# Altium schematic sheet Power.SchDoc
size A3
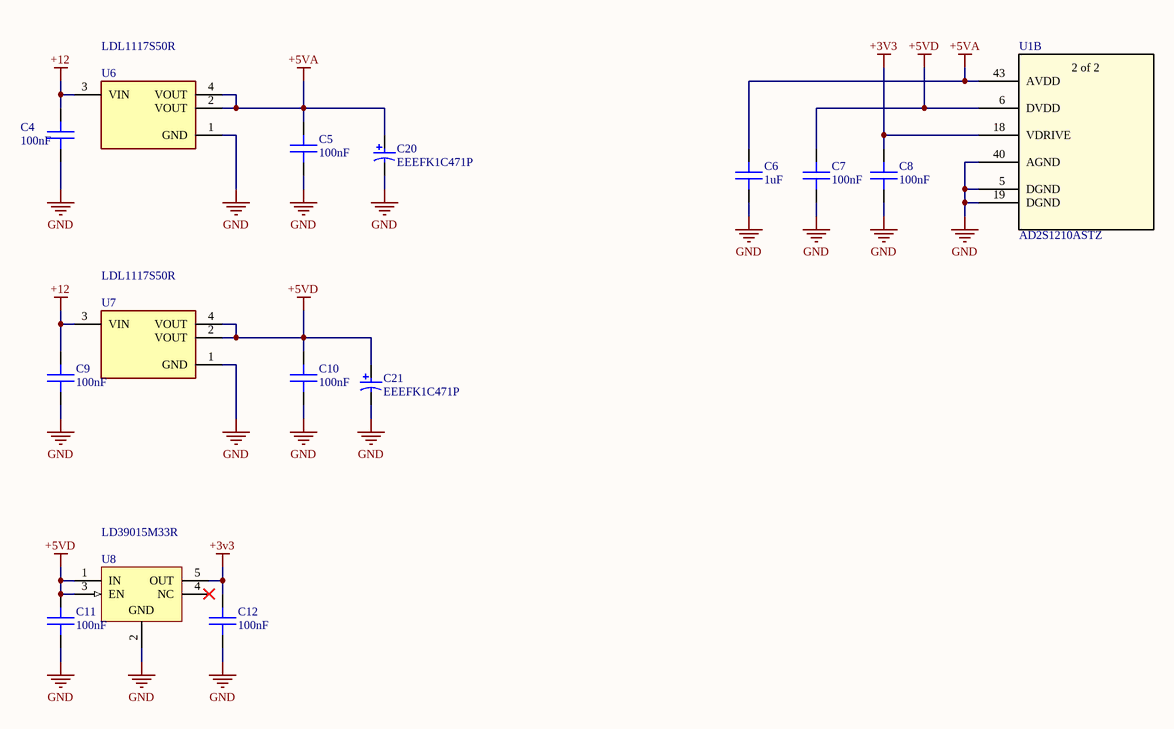
[diagram p0: Power.SchDoc]

## Parts
C4  value 100nF  [C0603 (1608)]  (hidden comment: Cap SMD)
C5  value 100nF  [C0603 (1608)]  (hidden comment: Cap SMD)
C6  value 1uF  [C0603 (1608)]  (hidden comment: Cap SMD)
C7  value 100nF  [C0603 (1608)]  (hidden comment: Cap SMD)
C8  value 100nF  [C0603 (1608)]  (hidden comment: Cap SMD)
C9  value 100nF  [C0603 (1608)]  (hidden comment: Cap SMD)
C10  value 100nF  [C0603 (1608)]  (hidden comment: Cap SMD)
C11  value 100nF  [C0603 (1608)]  (hidden comment: Cap SMD)
C12  value 100nF  [C0603 (1608)]  (hidden comment: Cap SMD)
C20  EEEFK1C471P  [PNSC-FK-V-F_V]
C21  EEEFK1C471P  [PNSC-FK-V-F_V]
U1  AD2S1210ASTZ  [ST_48_ADI]  (part B of 2)
U6  LDL1117S50R  [FP-SOT-223-0046067_14-MFG]
U7  LDL1117S50R  [FP-SOT-223-0046067_14-MFG]
U8  LD39015M33R  [SOT23-5L_M]

## Nets
+3V3: C8.2 C12.2 U1.18(VDRIVE) U8.5(OUT)
+5VA: C5.2 C6.2 C20.1 U1.43(AVDD) U6.2(VOUT) U6.4(VOUT)
+5VD: C7.2 C10.2 C11.2 C21.1 U1.6(DVDD) U7.2(VOUT) U7.4(VOUT) U8.1(IN) U8.3(EN)
+12: C4.2 C9.2 U6.3(VIN) U7.3(VIN)
GND: C4.1 C5.1 C6.1 C7.1 C8.1 C9.1 C10.1 C11.1 C12.1 C20.2 C21.2 U1.5(DGND) U1.19(DGND) U1.40(AGND) U6.1(GND) U7.1(GND) U8.2(GND)

Not connected (* = marked no-connect by the designer): U8 4(NC)*

## Notes on the sheet
- (in symbol AD2S1210ASTZ, part B) 2 of 2

## Library data of the parts
C20 C21 = CMP-2000-06204-1: Aluminum Electrolytic Capacitor, 470 uF, +/- 20%, 16 V, 2-Pin SMD (Size Code F), -55 to 105 degC, RoHS, Tape and Reel; Manufacturer: Panasonic; Capacitance: 470µF; Type: Can; Ripple Current: 600mA; Lifetime@Temperature: 2000Hrs@105°C; Impedance: 0.16O; Rated Voltage: 16V; Manufacturer URL: http://www.panasonic.com/; Package Description: 2-Pin Electrolytic Aluminum Capacitor, Body 8.3 x 8.3 mm; Operating Temp-Max: 105°C; Mounting Technology: SurfaceMount; Operating Temp Range: -55to+105°C; Datasheet Version: 03/2016; Series: FK; Package Reference: FK-V-F; Case Size/Dimension: Ø8x10.2mm; Package URL: http://industrial.panasonic.com/cdbs/www-data/pdf/RDE0000/DME0000COL48.pdf; Datasheet URL: http://industrial.panasonic.com/cdbs/www-data/pdf/RDE0000/ABA0000C1181.pdf
U1 = AD2S1210ASTZ: No Description Available; SourceLibrary: Analog_2015-12-15; Built_By: EMA_UL_Team; Vendor: Analog Devices Inc; Manufacturer_Part_Number: AD2S1210ASTZ; Copyright: Copyright (C) 2018 Accelerated Designs. All rights reserved; RefDes: RefDes; Type: DEV
U6 U7 = CMP-12153-000005-1: IC REG LINEAR 5V 1.2A SOT223; Manufacturer: STMicroelectronics; Standoff Height: 0.02mm; Min Supply Voltage: 2.6V; Nominal Supply Current: 250uA; Max Junction Temp: +150°C; Accuracy Percentage: 2%; Output Type: Fixed; Max Supply Voltage: 18V; Output Current: 2A; Number Of Outputs: 1; Dropout Voltage: 350mV; ComponentLink2Description: Datasheet; Temperature Range High: +125°C; Manufacturer Part Number: LDL1117S50R; Digikey Description: IC REG LINEAR 5V 1.2A SOT223; Device Class L2: Power Management ICs; RoHS: TRUE; Temperature: -40°C to +125°C; Device Class L3: Voltage Regulators - Linear; Automotive: No; Mouser Description: LDL1117 Series 1.2 A 5 V High PSRR LDO Linear Voltage Regulator - SOT-223; Package: SOT-223-0046067_14; ComponentLink2URL: https://www.st.com/content/ccc/resource/technical/document/datasheet/group3/0e/5a/00/ca/10/1a/4f/a5/DM00366442/files/DM00366442.pdf/jcr:content/translations/en.DM00366442.pdf; Output Voltage: 5V; Octopart: https://octopart.com/ldl1117s50r-stmicroelectronics-81876164; Category: IC; Device Class L1: Integrated Circuits (ICs); Temperature Range Low: -40°C; Height: 1.9mm; Lead Free: Yes
U8 = CMP-0244-00351-1: 150 mA Low Quiescent Current Low Noise Voltage Regulator, 3.3V, 5-Pin SOT-23, Tape and Reel; PackageReference: SOT23-5L; ComponentLink1URL: http://www.st.com; PackageDescription: 5-Pin SOT-23 Package, 2.9 x 1.6 mm Body, 0.95 mm Pitch, 2.8 mm Lead Span; ComponentLink2Description: Datasheet; DatasheetVersion: 1/02/2009; ComponentLink1Description: Manufacturer URL; ComponentLink2URL: http://www.st.com/internet/com/TECHNICAL_RESOURCES/TECHNICAL_LITERATURE/DATASHEET/CD00173477.pdf; PackageVersion: 1/01/2008